# Altium project photodiodeAmplifier.PrjPcb
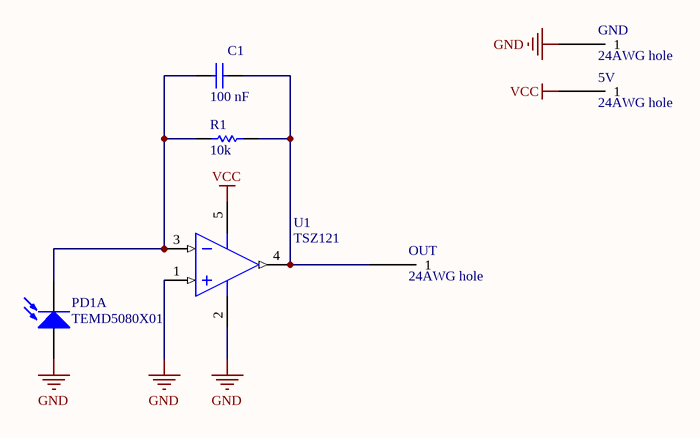
[diagram p0: photodiodeAmplifier.SchDoc]
1 sheet, 7 parts. Net scope: global (net labels, ports and power ports of the same name join across sheets).

## Sheet photodiodeAmplifier.SchDoc
size A4

### Parts
5V  24AWG hole  [24AWG hole]
C1  100 nF  [CAP 0805]
GND  24AWG hole  [24AWG hole]
OUT  24AWG hole  [24AWG hole]
PD1  TEMD5080X01  [Photodiode SMD PKG-1]  (part A of 2)
R1  value 10k  [RES 0805]  (hidden comment: RES 0805)
U1  TSZ121  [SC-70-5]

### Nets
GND: GND.1 PD1.1 U1.1(INA+) U1.2(V-)
VCC: 5V.1 U1.5(V+)
NetC1_1: C1.1 PD1.2 R1.1 U1.3(INA-)
NetC1_2: C1.2 OUT.1 R1.2 U1.4(OUTA)

### Library data of the parts
C1 = CAP 0805: Value: 5 pF
PD1 = TEMD5080X01: PIN Sillicium photodiode.
R1 = RES 0805: SMD Resistor 0805